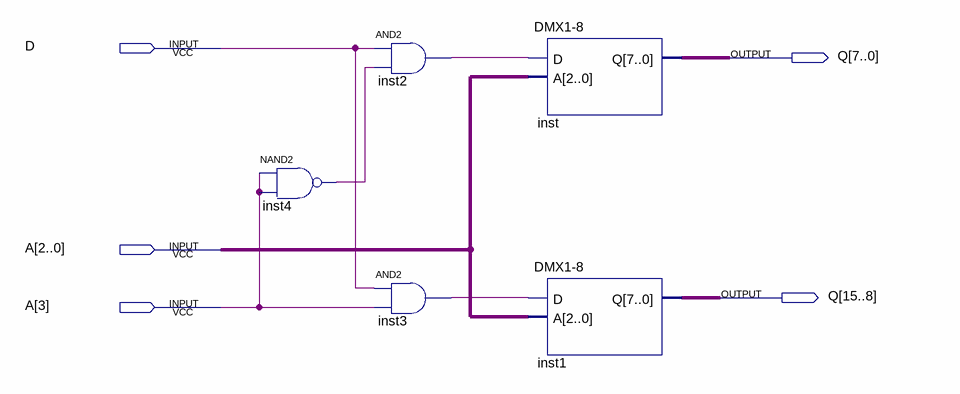
[diagram p0: schematic sheet]
// Quartus schematic DMUX_1_16.bdf as structural Verilog: 5 symbols, 5 pins
module DMUX_1_16 (
  input  D,
  input  [3:0] A,
  output [15:0] Q
);

  wire inst2_out, inst3_out, inst4_out;

  nand inst4 (inst4_out, A[3], A[3]);
  and inst2 (inst2_out, D, inst4_out);
  and inst3 (inst3_out, D, A[3]);
  \DMX1-8  inst (.D(inst2_out), .A(A[2:0]), .Q(Q[7:0]));
  \DMX1-8  inst1 (.D(inst3_out), .A(A[2:0]), .Q(Q[15:8]));
endmodule
